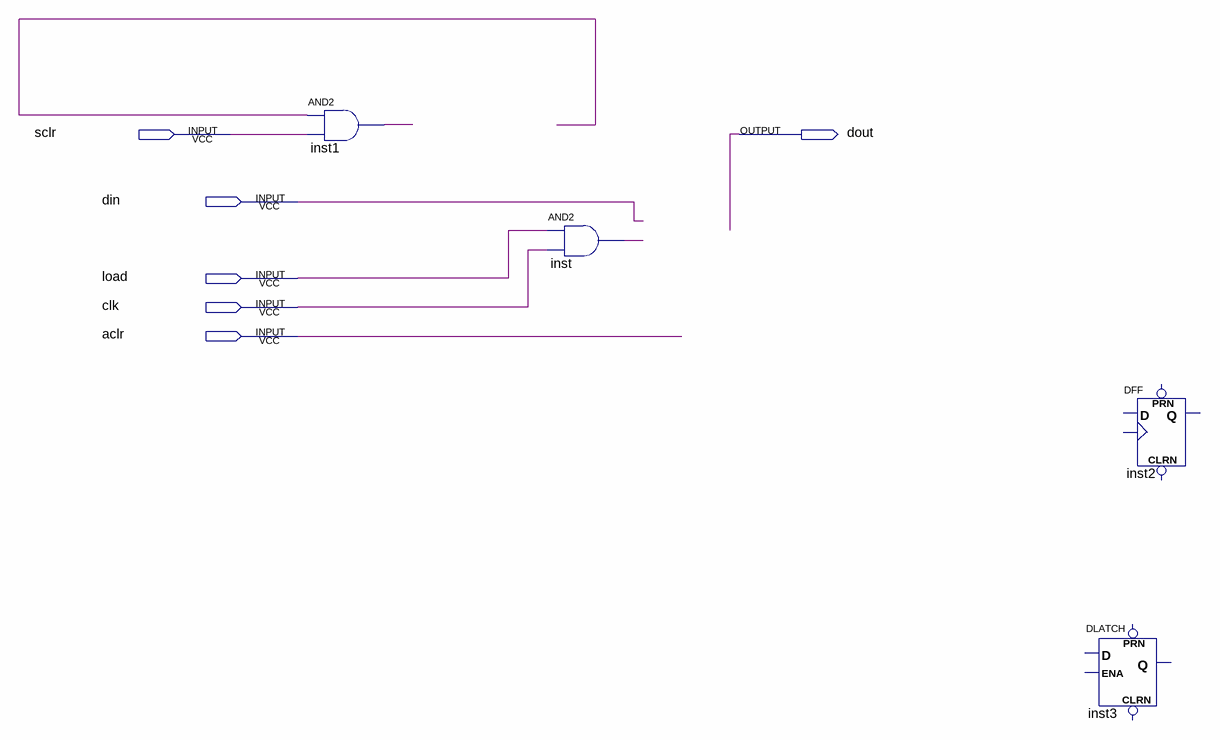
[diagram p0: schematic sheet]
// Quartus schematic reg1bit.bdf as structural Verilog: 4 symbols, 6 pins
module reg1bit (
  input  sclr,
  input  din,
  input  load,
  input  clk,
  input  aclr,
  output dout
);

  wire inst1_out, inst_out, undriven;

  and inst1 (inst1_out, undriven, sclr);
  and inst (inst_out, load, clk);
  DLATCH inst3 ();  // open: CLRN, D, ENA, PRN, Q
  DFF inst2 ();  // open: CLRN, CLK, D, PRN, Q
endmodule
